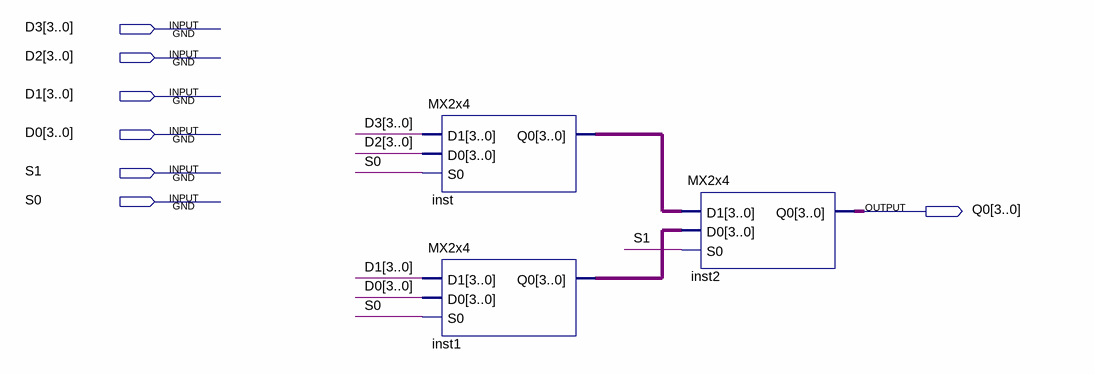
[diagram p0: schematic sheet]
// Quartus schematic MX4x4.bdf as structural Verilog: 3 symbols, 7 pins
module MX4x4 (
  input  [3:0] D3,
  input  [3:0] D2,
  input  [3:0] D1,
  input  [3:0] D0,
  input  S1,
  input  S0,
  output [3:0] Q0
);

  wire [3:0] inst1_q0, inst_q0;

  MX2x4 inst (.D1(D3), .D0(D2), .S0(S0), .Q0(inst_q0));
  MX2x4 inst1 (.D1(D1), .D0(D0), .S0(S0), .Q0(inst1_q0));
  MX2x4 inst2 (.D1(inst_q0), .D0(inst1_q0), .S0(S1), .Q0(Q0));
endmodule
